# Altium schematic sheet uC.SchDoc
size A
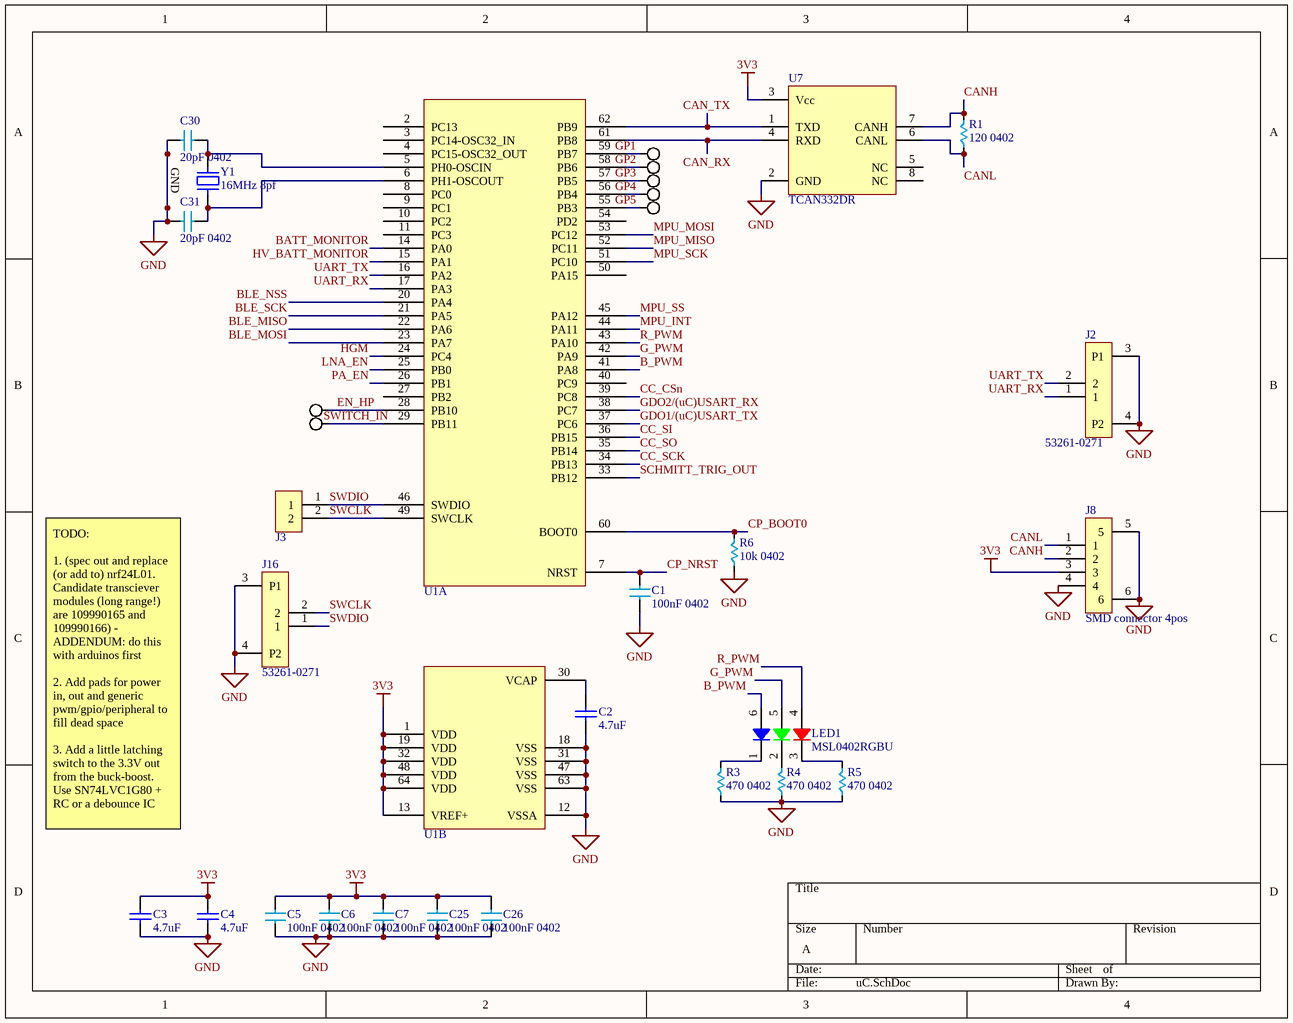
[diagram p0: uC.SchDoc]

## Parts
C1  100nF 0402  [C0402]
C2  value 4.7uF  [C0603]  (hidden comment: 4.7uF 0603)
C3  value 4.7uF  [C0603]  (hidden comment: 4.7uF 0603)
C4  value 4.7uF  [C0603]  (hidden comment: 4.7uF 0603)
C5  100nF 0402  [C0402]
C6  100nF 0402  [C0402]
C7  100nF 0402  [C0402]
C25  100nF 0402  [C0402]
C26  100nF 0402  [C0402]
C30  20pF 0402  [C0402]
C31  20pF 0402  [C0402]
J2  53261-0271  [0532610271]
J3  Header 2  [DUAL_PADS]  (value not drawn)
J5  PAD-SINGLE  [PAD-SINGLE]  (value not drawn)
J6  PAD-SINGLE  [PAD-SINGLE]  (value not drawn)
J8  SMD connector 4pos  [0532610471]
J9  PAD-SINGLE  [PAD-SINGLE]  (value not drawn)
J10  PAD-SINGLE  [PAD-SINGLE]  (value not drawn)
J11  PAD-SINGLE  [PAD-SINGLE]  (value not drawn)
J12  PAD-SINGLE  [PAD-SINGLE]  (value not drawn)
J13  PAD-SINGLE  [PAD-SINGLE]  (value not drawn)
J16  53261-0271  [533980271]
LED1  MSL0402RGBU  [MSL0402RGBU]
R1  120 0402  [R0402]
R3  470 0402  [R0402]
R4  470 0402  [R0402]
R5  470 0402  [R0402]
R6  10k 0402  [R0402]
U1  STM32F730R8T6  [QFP-64]  (value not drawn)  (parts A,B of 2)
U7  TCAN332DR  [SOIC8-D0008A]
Y1  16MHz 8pf  [NDK NX3225GA]

## Nets
3V3: C3.2 C4.2 C5.1 C6.1 C7.1 C25.1 C26.1 J8.3 U1.1(VDD) U1.13(VREF+) U1.19(VDD) U1.32(VDD) U1.48(VDD) U1.64(VDD) U7.3(Vcc)
GND: C1.2 C2.1 C3.1 C4.1 C5.2 C6.2 C7.2 C25.2 C26.2 C30.2 C31.2 J2.3(P1) J2.4(P2) J8.4 J8.5 J8.6 J16.3(P1) J16.4(P2) R3.2 R4.2 R5.2 R6.2 U1.12(VSSA) U1.18(VSS) U1.31(VSS) U1.47(VSS) U1.63(VSS) U7.2(GND) Y1.2(GND) Y1.4(GND)
B_PWM: LED1.6 U1.41(PA8)
BATT_MONITOR: U1.14(PA0)
BLE_MISO: U1.22(PA6)
BLE_MOSI: U1.23(PA7)
BLE_NSS: U1.20(PA4)
BLE_SCK: U1.21(PA5)
CAN_RX: U1.61(PB8) U7.4(RXD)
CAN_TX: U1.62(PB9) U7.1(TXD)
CANH: J8.2 R1.1 U7.7(CANH)
CANL: J8.1 R1.2 U7.6(CANL)
CC_CSn: U1.39(PC8)
CC_SCK: U1.34(PB13)
CC_SI: U1.36(PB15)
CC_SO: U1.35(PB14)
CP_BOOT0: R6.1 U1.60(BOOT0)
CP_NRST: C1.1 U1.7(NRST)
EN_HP: J12.1 U1.28(PB10)
G_PWM: LED1.5 U1.42(PA9)
GDO1/(uC)USART_TX: U1.37(PC6)
GDO2/(uC)USART_RX: U1.38(PC7)
GP1: J5.1 U1.59(PB7)
GP2: J6.1 U1.58(PB6)
GP3: J9.1 U1.57(PB5)
GP4: J10.1 U1.56(PB4)
GP5: J11.1 U1.55(PB3)
HGM: U1.24(PC4)
HV_BATT_MONITOR: U1.15(PA1)
LNA_EN: U1.25(PB0)
MPU_INT: U1.44(PA11)
MPU_MISO: U1.52(PC11)
MPU_MOSI: U1.53(PC12)
MPU_SCK: U1.51(PC10)
MPU_SS: U1.45(PA12)
PA_EN: U1.26(PB1)
R_PWM: LED1.4 U1.43(PA10)
SCHMITT_TRIG_OUT: U1.33(PB12)
SWCLK: J3.2 J16.2 U1.49(SWCLK)
SWDIO: J3.1 J16.1 U1.46(SWDIO)
SWITCH_IN: J13.1 U1.29(PB11)
UART_RX: J2.1 U1.17(PA3)
UART_TX: J2.2 U1.16(PA2)
NetC2_2: C2.2 U1.30(VCAP)
NetC30_1: C30.1 U1.5(PH0-OSCIN) Y1.1
NetC31_1: C31.1 U1.6(PH1-OSCOUT) Y1.3
NetLED1_1: LED1.1 R3.1
NetLED1_2: LED1.2 R4.1
NetLED1_3: LED1.3 R5.1

Not connected (* = marked no-connect by the designer): U1 2(PC13) 3(PC14-OSC32_IN) 4(PC15-OSC32_OUT) 8(PC0) 9(PC1) 10(PC2) 11(PC3) 27(PB2) 40(PC9) 50(PA15) 54(PD2); U7 5(NC) 8(NC)

## Notes on the sheet
- TODO:
  1. (spec out and replace (or add to) nrf24L01. Candidate transciever modules (long range!) are 109990165 and 109990166) - ADDENDUM: do this with arduinos first
  2. Add pads for power in, out and generic pwm/gpio/peripheral to fill dead space
  3. Add a little latching switch to the 3.3V out from the buck-boost. Use SN74LVC1G80 + RC or a debounce IC

## Library data of the parts
C1 C5-C7 C25 C26 = C0402-100nF
C2-C4 = C-4.7uF-0603: Manufacturer: Samsung; Manufacturer Part Number: CL05F104ZO5NNNC; Description 1: Cap Ceramic 0.1uF 16V Y5V -20% to 80% SMD 0402 85C T/R; Material: Ceramic; Tolerance: 80%; Capacitance: 100nF; Dielectric: Y5V; Voltage Rating: 16V; Description 2: Cap Ceramic 4.7uF 6.3V X5R 20% SMD 0603 85C Paper T/R; Voltage Rating (DC): 6.3V; Published: 8-Jun-2000; LatestRevisionDate: 17-Jul-2002; LatestRevisionNote: Re-released for DXP Platform.; PackageReference: RAD-0.3; Publisher: Altium Limited; Supplier 1: Digi-Key; Supplier Part Number 1: 1276-1004-6-ND; Stock: 8058560; Pricing: 1=0.1, 10=0.024, 100=0.0106, 500=0.00756, 1000=0.00595, 2500=0.00541, 5000=0.00497 (USD); Mount: Surface Mount; Case/Package: 0402; Case Code (Metric): 1005; Case Code (Imperial): 0402; Contact Plating: Tin; Min Operating Temperature: -30°C; Max Operating Temperature: 85°C; Packaging: Tape and Reel; Length: 1mm; Height: 0.5mm; Width: 0.02inch; Thickness: 0.022inch; Depth: 0.5mm; Radiation Hardening: No; ComponentLink1URL: http://www1.futureelectronics.com/doc/SAMSUNG/CL05F104ZO5NNNC.pdf; ComponentLink1Description: http://www1.futureelectronics.com/doc/SAMSUNG/CL05F104ZO5NNNC.pdf; ComponentLink2URL: https://www.verical.com/server-webapp/html/getDatasheet?partID=358403; ComponentLink2Description: https://www.verical.com/server-webapp/html/getDatasheet?partID=358403; ComponentLink3URL: https://produktinfo.conrad.com/datenblaetter/450000-474999/458504-da-01-en-VS_KONDENSATOR_0402.pdf; ComponentLink3Description: https://produktinfo.conrad.com/datenblaetter/450000-474999/458504-da-01-en-VS_KONDENSATOR_0402.pdf; Supplier 2: Digi-Key; Supplier Part Number 2: 1276-1907-6-ND; Manufacturer Part Number 2: CL10A475MQ8NNNC; Package Quantity: 4000; Lead Free: Lead Free; ComponentLink4URL: http://www.samsungsem.com/kr/support/product-search/mlcc/CL10A475MQ8NNNC.jsp?src-supplier=Digi-Key; ComponentLink4Description: http://www.samsungsem.com/kr/support/product-search/mlcc/CL10A475MQ8NNNC.jsp?src-supplier=Digi-Key; ComponentLink5URL: https://www.verical.com/server-webapp/html/getDatasheet?partID=358407&src-supplier=Verical; ComponentLink5Description: https://www.verical.com/server-webapp/html/getDatasheet?partID=358407&src-supplier=Verical; ComponentLink6URL: http://www1.futureelectronics.com/doc/SAMSUNG%20PASSIVE/CL05B104KQ5NNNC.pdf?src-supplier=Future+Electronics; ComponentLink6Description: http://www1.futureelectronics.com/doc/SAMSUNG%20PASSIVE/CL05B104KQ5NNNC.pdf?src-supplier=Future+Electronics
C30 C31 = C0402-20pF
J2 J16 = 53261-0271: Headers & Wire Housings 1.25MM HDR 2 CKT Right-Angle; Manufacturer: Molex; Gender: Male; Voltage Rating: 125V; Number of Positions: 2; Current Rating: 1A; Contact Resistance: 20mR; Insulation Resistance: 100MR; Glow Wire Compliant: Non-compliant; Supplier 1: Digi-Key; Supplier Part Number 1: WM7620TR-ND; Manufacturer Part Number 1: 53261-0271; Description 1: Headers & Wire Housings 1.25MM HDR 2 CKT Right-Angle; Stock: 85000; Pricing: 1000=0.4904, 2000=0.45975, 3000=0.44443, 5000=0.4291, 10000=0.40765, 25000=0.39845 (USD); Mount: Surface Mount; Color: Beige; Housing Material: Thermoplastic; Contact Material: Bronze,Tin; Contact Plating: Tin; Min Operating Temperature: -40°C; Max Operating Temperature: 85°C; Packaging: Tape and Reel; Termination: SMD/SMT; Number of Rows: 1; Number of Contacts: 2; Orientation: Right Angle; Package Quantity: 1000; Voltage Rating (AC): 125V; Number of Circuits: 2; Voltage Rating (DC): 125V; Working Voltage: 125V; Pitch: 1.25mm; Lead Pitch: 1.25mm; Radiation Hardening: No; REACH SVHC: Unknown; Lead Free: Lead Free; Flammability Rating: UL94 V-0; ComponentLink1URL: http://uk.rs-online.com/webdocs/13c4/0900766b813c44b8.pdf; ComponentLink1Description: http://uk.rs-online.com/webdocs/13c4/0900766b813c44b8.pdf; ComponentLink2URL: http://www.molex.com/webdocs/datasheets/pdf/en-us/0532610271_PCB_HEADERS.pdf; ComponentLink2Description: http://www.molex.com/webdocs/datasheets/pdf/en-us/0532610271_PCB_HEADERS.pdf; ComponentLink3URL: http://www.alliedelec.com/m/d/74d14d19c60ab078e4881c4c1bd42ef7.pdf; ComponentLink3Description: http://www.alliedelec.com/m/d/74d14d19c60ab078e4881c4c1bd42ef7.pdf; ComponentLink4URL: http://www.farnell.com/datasheets/2697765.pdf; ComponentLink4Description: http://www.farnell.com/datasheets/2697765.pdf; ComponentLink5URL: http://www.farnell.com/datasheets/2144535.pdf; ComponentLink5Description: http://www.farnell.com/datasheets/2144535.pdf; ComponentLink6URL: http://www.farnell.com/datasheets/1626147.pdf; ComponentLink6Description: http://www.farnell.com/datasheets/1626147.pdf; ComponentLink7URL: http://www.mouser.com/ds/2/276/0532610271_PCB_HEADERS-171053.pdf; ComponentLink7Description: http://www.mouser.com/ds/2/276/0532610271_PCB_HEADERS-171053.pdf; ComponentLink8URL: http://www.farnell.com/datasheets/2038817.pdf; ComponentLink8Description: http://www.farnell.com/datasheets/2038817.pdf; ComponentLink9URL: http://www.jameco.com/Jameco/Products/ProdDS/1932547.pdf; ComponentLink9Description: http://www.jameco.com/Jameco/Products/ProdDS/1932547.pdf
J3 = DUAL_PADS
J5 J6 J9-J13 = PAD-SINGLE: Single Thru Hole Pad
J8 = 0532610471: Headers & Wire Housings 1.25MM HDR 4 CKT Right-Angle; Manufacturer: Molex; Manufacturer Part Number 1: 53261-0471; Contact Resistance: 20mR; Number of Positions: 4; Current Rating: 1A; Voltage Rating (AC): 125V; Insulation Resistance: 100MR; Gender: Male; Glow Wire Compliant: Non-compliant; Supplier 1: Digi-Key; Supplier Part Number 1: WM7622DKR-ND; Description 1: Headers & Wire Housings 1.25MM HDR 4 CKT Right-Angle; Stock: 42057; Pricing: 1=1.24, 10=1.089, 100=0.9397, 500=0.76884 (USD); Mount: Surface Mount; Contact Plating: Tin; Contact Material: Bronze,Tin; Color: Beige; Housing Material: Thermoplastic; Min Operating Temperature: -40°C; Max Operating Temperature: 85°C; Orientation: Right Angle; Number of Rows: 1; Packaging: Tape and Reel; Termination: SMD/SMT; Number of Contacts: 4; Voltage Rating: 125V; Package Quantity: 1000; Working Voltage: 125V; Number of Circuits: 4; Voltage Rating (DC): 125V; Pitch: 1.25mm; Lead Pitch: 1.25mm; Radiation Hardening: No; Flammability Rating: UL94 V-0; REACH SVHC: Unknown; Lead Free: Lead Free; ComponentLink1URL: http://www.mouser.com/ds/2/276/0532610471_PCB_HEADERS-170942.pdf; ComponentLink1Description: http://www.mouser.com/ds/2/276/0532610471_PCB_HEADERS-170942.pdf; ComponentLink2URL: http://uk.rs-online.com/webdocs/1380/0900766b8138010d.pdf; ComponentLink2Description: http://uk.rs-online.com/webdocs/1380/0900766b8138010d.pdf; ComponentLink3URL: http://www.farnell.com/datasheets/1867384.pdf; ComponentLink3Description: http://www.farnell.com/datasheets/1867384.pdf; ComponentLink4URL: http://www.molex.com/webdocs/datasheets/pdf/en-us/0532610471_PCB_HEADERS.pdf; ComponentLink4Description: http://www.molex.com/webdocs/datasheets/pdf/en-us/0532610471_PCB_HEADERS.pdf; ComponentLink5URL: https://www.alliedelec.com/m/d/74d14d19c60ab078e4881c4c1bd42ef7.pdf; ComponentLink5Description: https://www.alliedelec.com/m/d/74d14d19c60ab078e4881c4c1bd42ef7.pdf; ComponentLink6URL: http://www.jameco.com/Jameco/Products/ProdDS/1932555.pdf; ComponentLink6Description: http://www.jameco.com/Jameco/Products/ProdDS/1932555.pdf
LED1 = MSL0402RGBU: ROHM         MSL0402RGBU1             LED, Red, Green, Blue, SMD, Rectangular, R 20mA, G 20mA, B 20mA                          New; Color: Blue,Green,Red; Supplier 1: Digi-Key; Supplier Part Number 1: MSL0402RGBU1CT-ND; Manufacturer: Rohm; Manufacturer Part Number: MSL0402RGBU1; Stock 1: 23725; Pricing 1: 1=0.7, 10=0.549, 25=0.4576, 100=0.3942, 250=0.352, 500=0.30272, 1000=0.23373 (USD); Lens Style: Rectangular; Packaging: Cut Tape; REACH SVHC: No SVHC; Lead Free: Lead Free
R1 = R-120-0402: 120 Ohm 0402
R3-R5 = R-470-0402: Manufacturer: Yageo; Manufacturer Part Number: RC0402JR-07470RL; Description 1: RES SMD 470 OHM 5% 1/16W 0402; Tolerance: 5%; Voltage Rating: 50V; Resistance: 470R; Power Rating: 62.5mW; Temperature Coefficient: 100ppm/°C; Max Power Dissipation: 63mW; Supplier 1: Digi-Key; Supplier Part Number 1: 311-470JRDKR-ND; Stock: 2903670; Pricing: 1=0.1, 10=0.013, 100=0.0055, 1000=0.00245, 2500=0.00212, 5000=0.00176 (USD); Case/Package: 0402; Case Code (Metric): 1005; Case Code (Imperial): 0402; Min Operating Temperature: -55°C; Max Operating Temperature: 155°C; Packaging: Tape and Reel; Package Quantity: 1; Termination: SMD/SMT; Composition: Thick Film; Features: Moisture Resistant; Number of Terminations: 2; Military Standard: Not; Working Voltage: 50V; Length: 1mm; Height: 0.016inch; Width: 0.02inch; Depth: 0.5mm; REACH SVHC: Unknown; Lead Free: Lead Free; ComponentLink1URL: http://www.yageo.com/documents/recent/PYu-RC_Group_51_RoHS_L_10.pdf?src-supplier=Digi-Key; ComponentLink1Description: http://www.yageo.com/documents/recent/PYu-RC_Group_51_RoHS_L_10.pdf?src-supplier=Digi-Key; ComponentLink2URL: http://www.farnell.com/datasheets/1018594.pdf?src-supplier=Element14; ComponentLink2Description: http://www.farnell.com/datasheets/1018594.pdf?src-supplier=Element14; ComponentLink3URL: http://www.mouser.com/ds/2/447/PYu-RC0402_51_RoHS_L_6_r-8721.pdf?src-supplier=Mouser; ComponentLink3Description: http://www.mouser.com/ds/2/447/PYu-RC0402_51_RoHS_L_6_r-8721.pdf?src-supplier=Mouser
R6 = R-10k-0402: Value: 10k
U7 = TCAN332: Manufacturer: Texas Instruments; Description 1: TEXAS INSTRUMENTS         TCAN332DR             CAN Bus, 1, 1, 3 V, 3.6 V, SOIC; Receiver Hysteresis: 120mV; Data Rate: 1Mbps; Min Supply Voltage: 3V; Max Supply Voltage: 3.6V; Number of Transmit Buffers: 1; Supplier 1: Digi-Key; Supplier Part Number 1: 296-43711-1-ND; Manufacturer Part Number: TCAN332DR; RoHS: Yes; Category: Interface ICs; Stock: 14429; Pricing: 1=2.01000, 10=1.80200, 25=1.70000, 100=1.36000, 250=1.19000, 500=1.15600, 1000=0.91800 (USD); Mount: Surface Mount; Case/Package: SOIC; Number of Pins: 8; Min Operating Temperature: -40°C; Max Operating Temperature: 125°C; Packaging: Cut Tape; Number of Receive Buffers: 1; Lead Free: Lead Free; REACH SVHC: No SVHC; ComponentLink1URL: http://www.ti.com/lit/ds/symlink/tcan332.pdf?src-supplier=Digi-Key; ComponentLink1Description: http://www.ti.com/lit/ds/symlink/tcan332.pdf?src-supplier=Digi-Key; ComponentLink2URL: http://www.ti.com/lit/gpn/tcan332?src-supplier=Mouser; ComponentLink2Description: http://www.ti.com/lit/gpn/tcan332?src-supplier=Mouser; ComponentLink3URL: http://www.ti.com/general/docs/lit/getliterature.tsp?genericPartNumber=TCAN332&amp;&amp;fileType=pdf&src-supplier=Farnell; ComponentLink3Description: http://www.ti.com/general/docs/lit/getliterature.tsp?genericPartNumber=TCAN332&amp;&amp;fileType=pdf&src-supplier=Farnell; ComponentLink4URL: http://www.ti.com/general/docs/lit/getliterature.tsp?genericPartNumber=TCAN332&&fileType=pdf&src-supplier=Element14; ComponentLink4Description: http://www.ti.com/general/docs/lit/getliterature.tsp?genericPartNumber=TCAN332&&fileType=pdf&src-supplier=Element14
Y1 = NDK Crystal NX3225SA: SMT Crystal; Manufacturer: NDK; Manufacturer Part Number: NX3225SA-16.000000MHZ-T1; Description 2: CRYSTAL 16.0000MHZ 10PF SMD; Frequency Tolerance: 10ppm; Load Capacitance: 10pF; ESR (Equivalent Series Resistance): 80R; Supplier 1: Digi-Key; Supplier Part Number 1: 644-1049-1-ND; Supplier 2: Digi-Key; Supplier Part Number 2: 644-1100-6-ND; Stock: 72540; Pricing: 1=0.92, 10=0.812, 50=0.7592, 100=0.6709, 500=0.63558, 1000=0.52965 (USD); Mount: Surface Mount; Case/Package: SMD/SMT; Min Operating Temperature: -20°C; Max Operating Temperature: 70°C; Frequency: 16MHz; Frequency Stability: 10ppm; Packaging: Tape and Reel; Package Quantity: 3000; Length: 0.126inch; Height: 0.028inch; Width: 0.098inch; Lead Free: Lead Free; ComponentLink1URL: https://media.digikey.com/pdf/Data Sheets/NDK PDFs/NX3225SA-16.000000MHz-T1.pdf?src-supplier=Digi-Key; ComponentLink1Description: https://media.digikey.com/pdf/Data Sheets/NDK PDFs/NX3225SA-16.000000MHz-T1.pdf?src-supplier=Digi-Key